# EasyEDA Pro project reflow_controller_v2_with_serial_tx_rx_easyeda.epro

# Schematic reflow_controller_v2
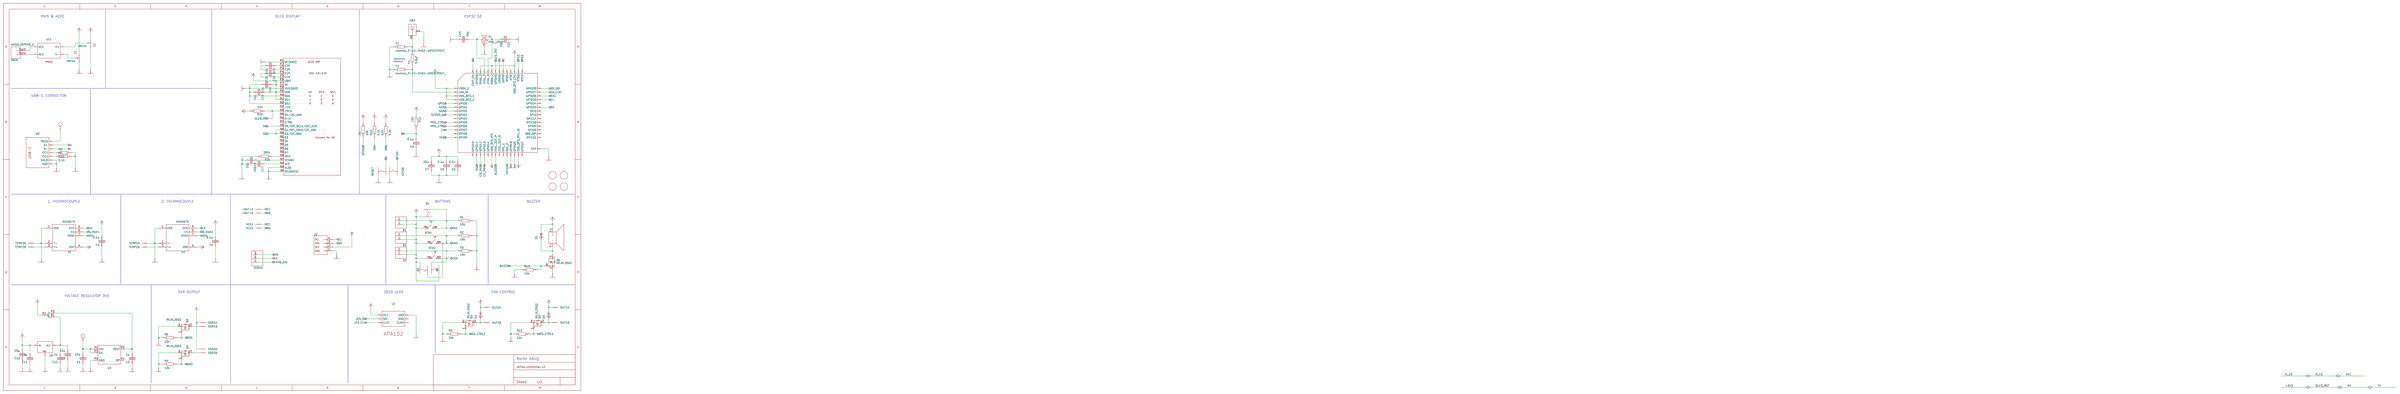
[diagram p0: schematic sheet]

## Parts
-OUT+  MOLEX_2MM_2P  (sections G$1,G$2)
B1  PINHD-1X02_2.00
B2  PINHD-1X02_2.00
B3  PINHD-1X02_2.00
B4  BUTTON_4PIN_TS-1070A
B5  BUTTON_4PIN_TS-1070A
B6  BUTTON_4PIN_TS-1070A
BTN1  BUTTON_6X6_SILICON
BTN2  BUTTON_6X6_SILICON
BTN3  BUTTON_6X6_SILICON
C1  10µ  [C0603]
C2  1µ
C3  0,1µ
C4  0,1µ
C5  0,1µ
C6  0,1µ
C7  10µ  [C0603]
C8  10µ  [C0603]
C9  0,1µ
C11  1µ
C12  1µ
C13  10µ  [C0603]
C14  2,2µ
C15  10p
C16  2,2µ
C17  10µ  [C0603]
C18  10µ  [C0603]
C19  10µ  [C0603]
C20  0,1µ
C21  10p
D1  DIODESOD-123
D2  DIODESOD-123
D4  DIODESOD-123
ESP  ESP32_S2_QFN56_NEW
F1  5.6pF
F2  moekoe_R-EU-0402-WOKEEPOUT_
F3  moekoe_R-EU-0402-WOKEEPOUT_
FRAME1  A3L-LOC
GPIO0  BUTTON_4PIN_TS_1177
J2  QWIIC_CONNECTORJS-1MM
JMP1  0R-JUMPA  (sections -0R,G$2)
JMP2  0R-JUMPA  (sections -0R,G$2)
L1  APA102_2020
MAIN  WAGO_AST045_2
OUT1  MOLEX_2MM_2P  (sections G$1,G$2)
OUT2  MOLEX_2MM_2P  (sections G$1,G$2)
Q1  IRLML2502
Q2  IRLML2502
Q4  IRLML2502
Q5  IRLML2502
Q6  IRLML2502
R1  10k
R2  10k
R3  10k
R4  10k
R5  10k
R6  5.1k
R7  5.1k
R8  10k
R9  10k
R11  10k
R12  10k
R13  10k
R20  10k
R21  390k
R22  5.1k
R23  5.1k
RESET  BUTTON_4PIN_TS_1177
S1  SWITCH_MS-22C01-G010
SERVO  PINHD-1X03_2.54
SSR1  MOLEX_2MM_2P  (sections G$1,G$2)
SSR2  MOLEX_2MM_2P  (sections G$1,G$2)
TEMP1  MOLEX_2MM_2P  (sections G$1,G$2)
TEMP2  MOLEX_2MM_2P  (sections G$1,G$2)
U1  MAX6675
U2  MAX6675
U3  RT9193_SC70-5
U4  OLD_096_SSD1306_30P_2B
U8  V_REG_LM1117SOT223
U9  USB_C_C393939
U10  MLT-5030-BUZZER
U11  HILINK_PM03
U$1  FIDUCIAL
U$2  FIDUCIAL
U$3  UFL_ANT_CONNECTOR
U$4  FIDUCIAL
U$5  FIDUCIAL
VCC  MOLEX_2MM_2P  (sections G$1,G$2)
X1  XTAL_2016

## Library data of the parts
-OUT+ OUT1 OUT2 SSR1 SSR2 TEMP1 TEMP2 VCC = iml_apollo_MOLEX_2MM_2P_
B1-B3 = pinhead-2_PINHD-1X02__2.00
B4-B6 = moekoe_BUTTON_4PIN__TS-1070A
BTN1-BTN3 = moekoe_BUTTON_6X6_SILICON_
C1-C3 C5 C7-C9 C11-C21 = moekoe_C-EU_WO_KEEPOUT_
C4 C6 = rcl_C-EU_C0603
D1 D2 D4 = adafruit_DIODE_SOD-123
ESP = moekoe_ESP32_S2_QFN56__NEW
F1-F3 = moekoe_R-EU-0402-WOKEEPOUT_
FRAME1 = frames_A3L-LOC_: DRAWING_NAME: reflow_controller_v2; SHEET: 1/1
GPIO0 RESET = moekoe_BUTTON_4PIN__TS_1177
J2 = SparkFun-Connectors_QWIIC_CONNECTOR_JS-1MM
JMP1 JMP2 = jump-0r-smd_0R-JUMP_A
L1 = moekoe_APA102_2020_
MAIN = moekoe_WAGO_AST045_2_
Q1 Q2 Q4-Q6 = moekoe_IRLML2502_
R1-R9 R11-R13 R20-R23 = moekoe_R-EU_WO_KEEPOUT_
S1 = moekoe_SWITCH_MS-22C01-G010_
SERVO = pinhead-2_PINHD-1X03__2.54
U1 U2 = max6675_MAX6675_
U3 = moekoe_RT9193_SC70-5_
U4 = moekoe_OLD_096_SSD1306_30P__2B
U8 = SparkFun-IC-Power_V_REG_LM1117_SOT223
U9 = moekoe_USB_C_C393939_
U10 = moekoe_MLT-5030-BUZZER_
U11 = moekoe_HILINK_PM03_
U$1 U$2 U$4 U$5 = adafruit_FIDUCIAL_
U$3 = moekoe_UFL_ANT_CONNECTOR_
X1 = moekoe_XTAL_2016_

## Nets
+3V3: B1.1 B2.1 B3.1 B4.P$2(3) B5.P$2(3) B6.P$2(3) BTN1.P$1(P1) BTN2.P$1(P1) BTN3.P$1(P1) C3.2 C4.2 C5.2 C6.2 C7.2 C18.1 C20.1 D1.C ESP.1(VDDA) ESP.3(VDD_3P3_1) ESP.4(VDD_3P3_2) ESP.20(VDD_3P3_RTC) ESP.27(VDD_3P3_RTC_IO) ESP.45(VDD_3P3_CPU) ESP.48(U0TXD) ESP.49(U0RXD) ESP.50(GPIO45) ESP.51(VDDA_2) ESP.54(VDDA_3) J2.2(VCC) L1.P1*2(VCC) R9.2 R11.1 R20.1 R20.2 R22.2 R23.2 S1.P2(2) U1.4(VDD) U2.4(VDD) U4.P6(VBAT) U4.P9(VDD) U4.P11(BS1) U4.P14(/RES) U10.P+
GND: -OUT+.2(S) C1.1 C2.1 C3.1 C4.1 C5.1 C6.1 C7.1 C8.1 C9.1 C11.1 C12.1 C13.1 C15.1 C17.2 C18.2 C19.2 C20.2 C21.1 ESP.57(EXP) F2.1 F3.1 GPIO0.P1(1) J2.1(GND) JMP1.1 JMP2.1 L1.P6*2(GND) Q1.2(S) Q2.2(S) Q4.2(S) Q5.2(S) Q6.2(S) R1.2 R2.2 R3.2 R4.1 R5.1 R6.2 R7.2 R8.1 R12.1 R13.1 R21.2 RESET.P1(1) SERVO.3 TEMP1.1(S) TEMP2.1(S) U1.1(VSS) U1.2(T-) U2.1(VSS) U2.2(T-) U3.P2(GND) U4.P1(NC(GND)) U4.P8(VSS(GND)) U4.P10(BS0) U4.P12(BS2) U4.P29(VLSS) U4.P30(NC(GND2)) U8.1(ADJ) U9.A1B12*2(GND) U9.S1*4(SHLD) U$3.P1.-*2(GND) VCC.2(S) X1.P2*2(G)
VCC: -OUT+.1(S) C11.2 C13.2 D2.C D4.C JMP1.3 JMP2.2 JMP2.3 OUT1.1(S) OUT2.1(S) SERVO.2 SSR1.1(S) SSR2.1(S) U8.3(IN) U11.V+ VCC.1(S)
ANTENNA1: F1.2 F2.2 U$3.ANT
BTN1: B1.2 B4.P$4(2) BTN1.P$2(P2) ESP.40(GPIO36) R1.1
BTN2: B2.2 B5.P$4(2) BTN2.P$2(P2) ESP.43(MTCK) R2.1
BTN3: B3.2 B6.P$4(2) BTN3.P$2(P2) ESP.44(MTDO) R3.1
BUZZER: ESP.21(XTAL_32K_P) Q6.1(G) R13.2
CLK: ESP.12(GPIO7) U1.5(SCK) U2.5(SCK)
CS_MAX1: ESP.18(GPIO13) U1.6(CS)
CS_MAX2: ESP.17(GPIO12) U2.6(CS)
D+: ESP.26(GPIO20) U9.A6*2(D+)
D-: ESP.25(GPIO19) U9.A7*2(D-)
EN: C9.2 ESP.56(CHIP_PU) R11.2 RESET.P4(4)
GPIO0: ESP.5(GPIO0) GPIO0.P4(4)
GPIO18: ESP.24(DAC_2) R9.1
LED_CLKI: ESP.41(GPIO37) L1.P5(CLKI)
LED_SDI: ESP.42(GPIO38) L1.P4(SDI)
MISO: ESP.14(GPIO9) U1.7(MISO) U2.7(MISO)
MOS_CTRL1: ESP.11(GPIO6) Q2.1(G) R12.2
MOS_CTRL2: ESP.10(GPIO5) Q1.1(G) R5.2
MOSI: ESP.16(GPIO11)
N_1: MAIN.P1.1*2(1) U11.AC1
N_2: TEMP2.2(S) U1.3(T+)
N_3: MAIN.P2.1*2(2) U11.AC2
N_4: ESP.2(LNA_IN) F1.1 F3.2
N_5: D2.A OUT2.2(S) Q1.3(D)
N_6: D1.A Q6.3(D) U10.P-
N_7: D4.A OUT1.2(S) Q2.3(D)
N_9: Q4.3(D) SSR2.2(S)
N_11: C15.2 ESP.53(XTAL_P) X1.P1(1)
N_12: C21.2 ESP.52(XTAL_N) X1.P3(2)
N_14: TEMP1.2(S) U2.3(T+)
N_16: C8.2 C12.2 S1.P1(1) U8.2*2(OUT)
N_17: C14.1 U4.P2(C2P)
N_18: R7.1 U9.B5(CC2)
N_19: C14.2 U4.P3(C2N)
N_20: C16.2 U4.P5(C1N)
N_21: R21.1 U4.P26(IREF)
N_22: C2.2 S1.P3(3) U3.P5(VOUT)
N_23: JMP1.2 U11.V-
N_25: R6.1 U9.A5(CC1)
N_31: C16.1 U4.P4(C1P)
N_32: C17.1 U4.P28(VCC)
N_33: C19.1 U4.P27(VCOMH)
SCL: ESP.39(GPIO35) J2.4(SCL) R23.1 U4.P18(D0/SPI_SCLK/I2C_SCK)
SDA: ESP.37(GPIO33) J2.3(SDA) R22.1 U4.P19(D1/SPI_SDIN/I2C_SDA) U4.P20(D2/I2C_SDA)
SERVO_SIG: ESP.8(GPIO3) SERVO.1
SSR1: ESP.6(GPIO1) Q5.1(G) R8.2
SSR2: ESP.7(GPIO2) Q4.1(G) R4.2
VPP: C1.2 U3.P1(VIN) U3.P3(EN) U9.A4B9*2(VBUS)
N$10: Q5.3(D) SSR1.2(S)

Not connected (* = marked no-connect by the designer): B4 P$1(1) P$3(4); B5 P$1(1) P$3(4); B6 P$1(1) P$3(4); ESP 9(GPIO4) 13(GPIO8) 15(GPIO10) 19(GPIO14) 22(XTAL_32K_N) 23(DAC_1) 28(GPIO21) 29(SPICS1) 30(VDD_SPI) 31(SPIHD) 32(SPIWP) 33(SPICS0) 34(SPICLK) 35(SPIQ) 36(SPID) 38(GPIO34) 46(MTDI) 47(MTMS) 55(GPIO46); GPIO0 P2(2) P3(3); L1 P2(CLKO) P3(SDO); RESET P2(2) P3(3); U3 P4(BP); U4 P7(NC) P13(/CS) P15(DC/I2C_SA0) P16(R/W) P17(E/RD) P21(D3) P22(D4) P23(D5) P24(D6) P25(D7)

## Notes on the sheet
- MAIN & ACDC
- OLED DISPLAY
- ESP32 S2
- matching
  network
- USB-C CONNECTOR
- 1. THERMOCOUPLE
- 2. THERMOCOUPLE
- BUTTONS
- BUZZER
- SSR OUTPUT
- 2020 LEDS
- FAN CONTROL
- VOLTAGE REGULATOR 3V3
- Moritz König

# Board reflow_controller_v2
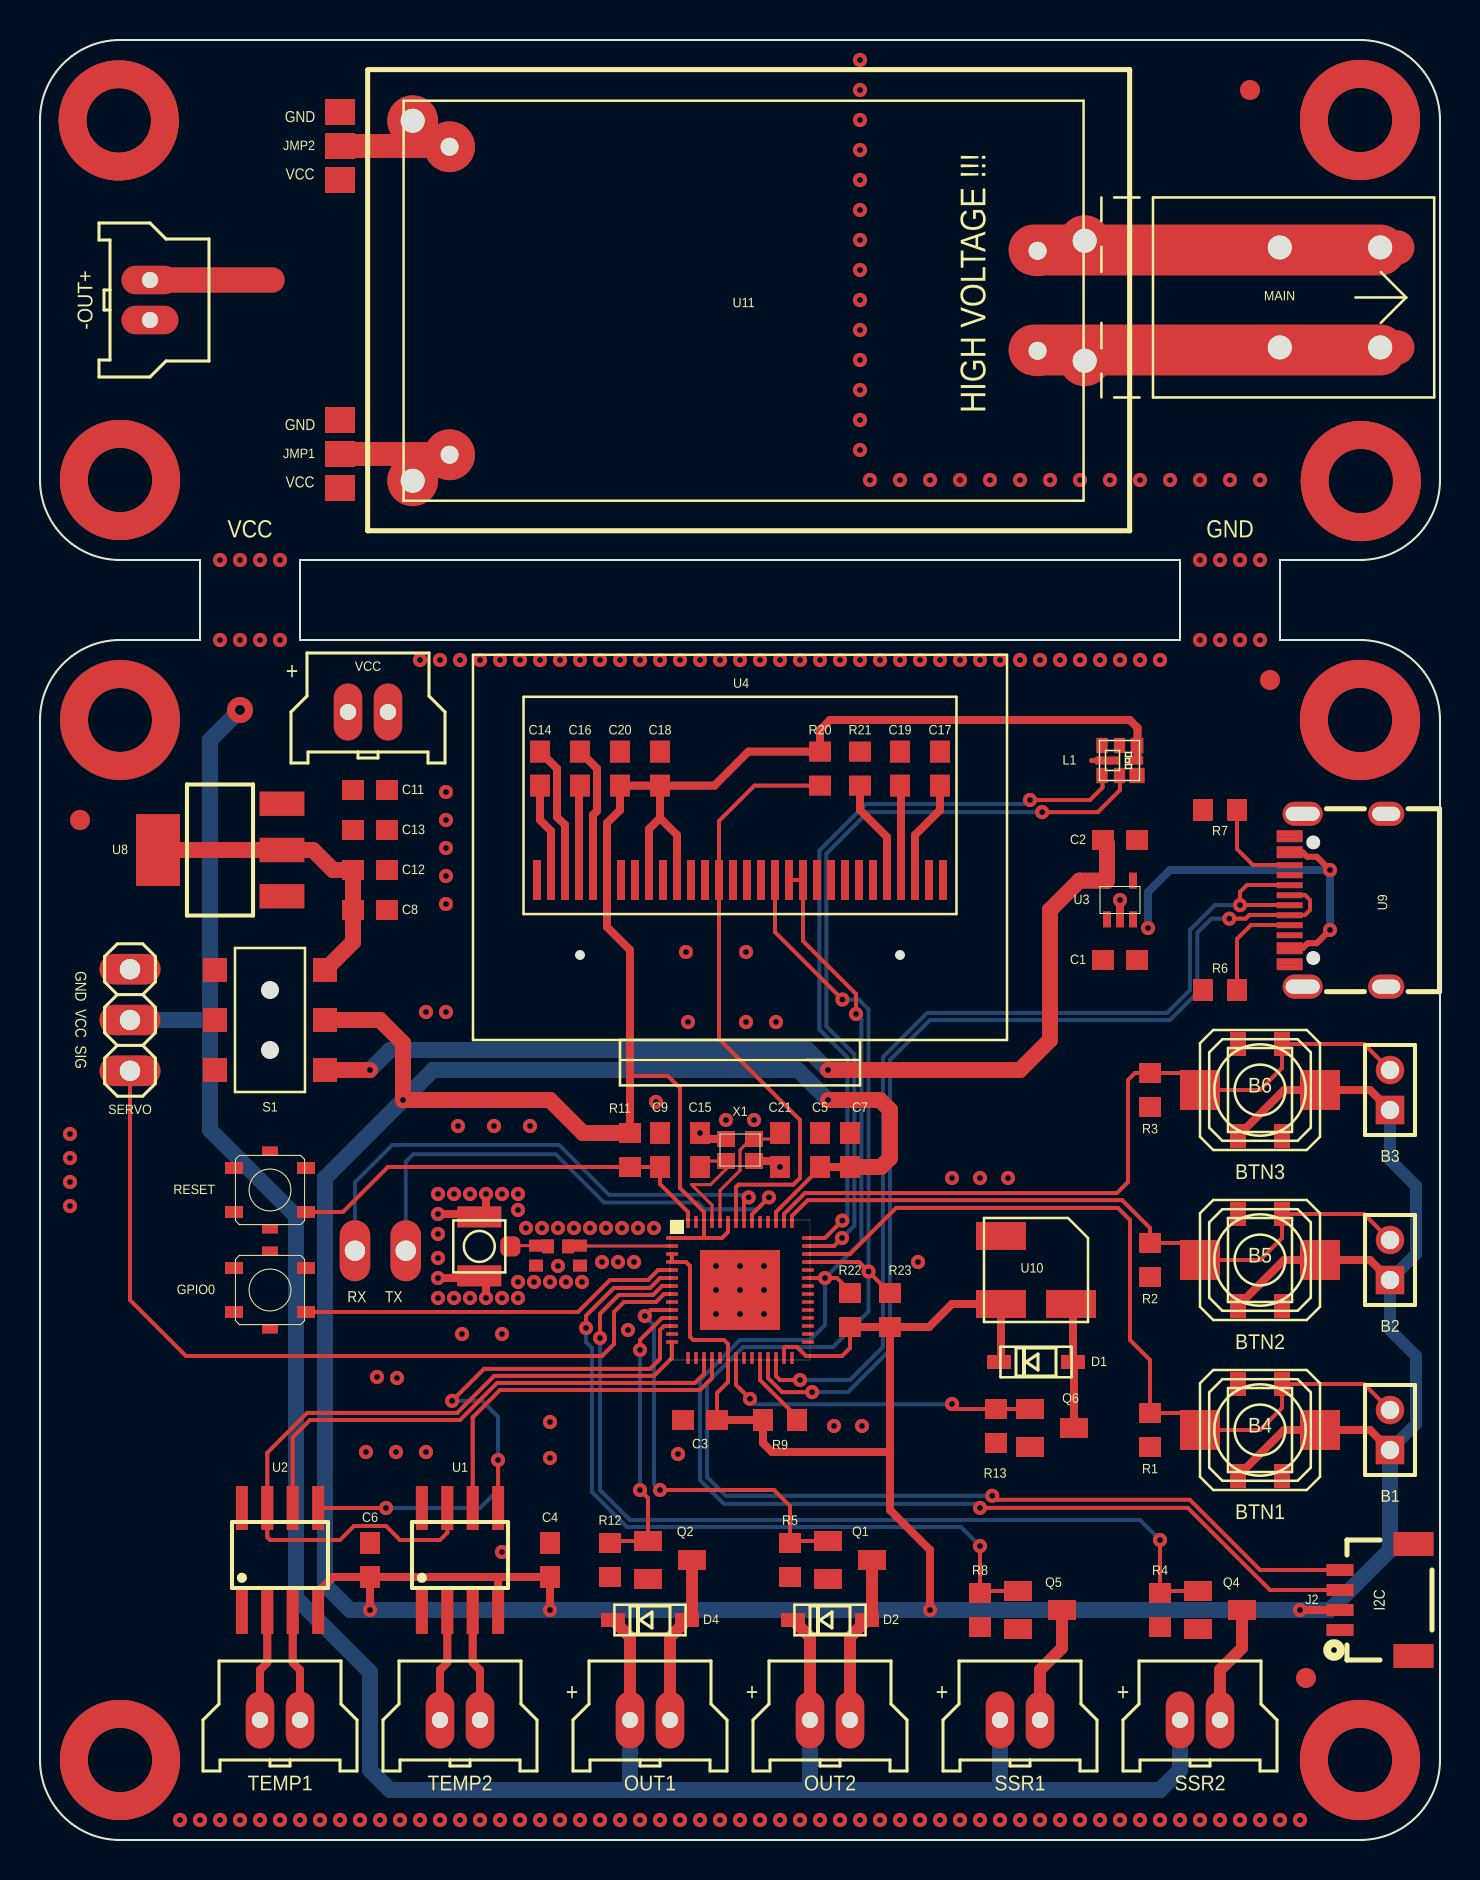
[diagram p1: board, top side]
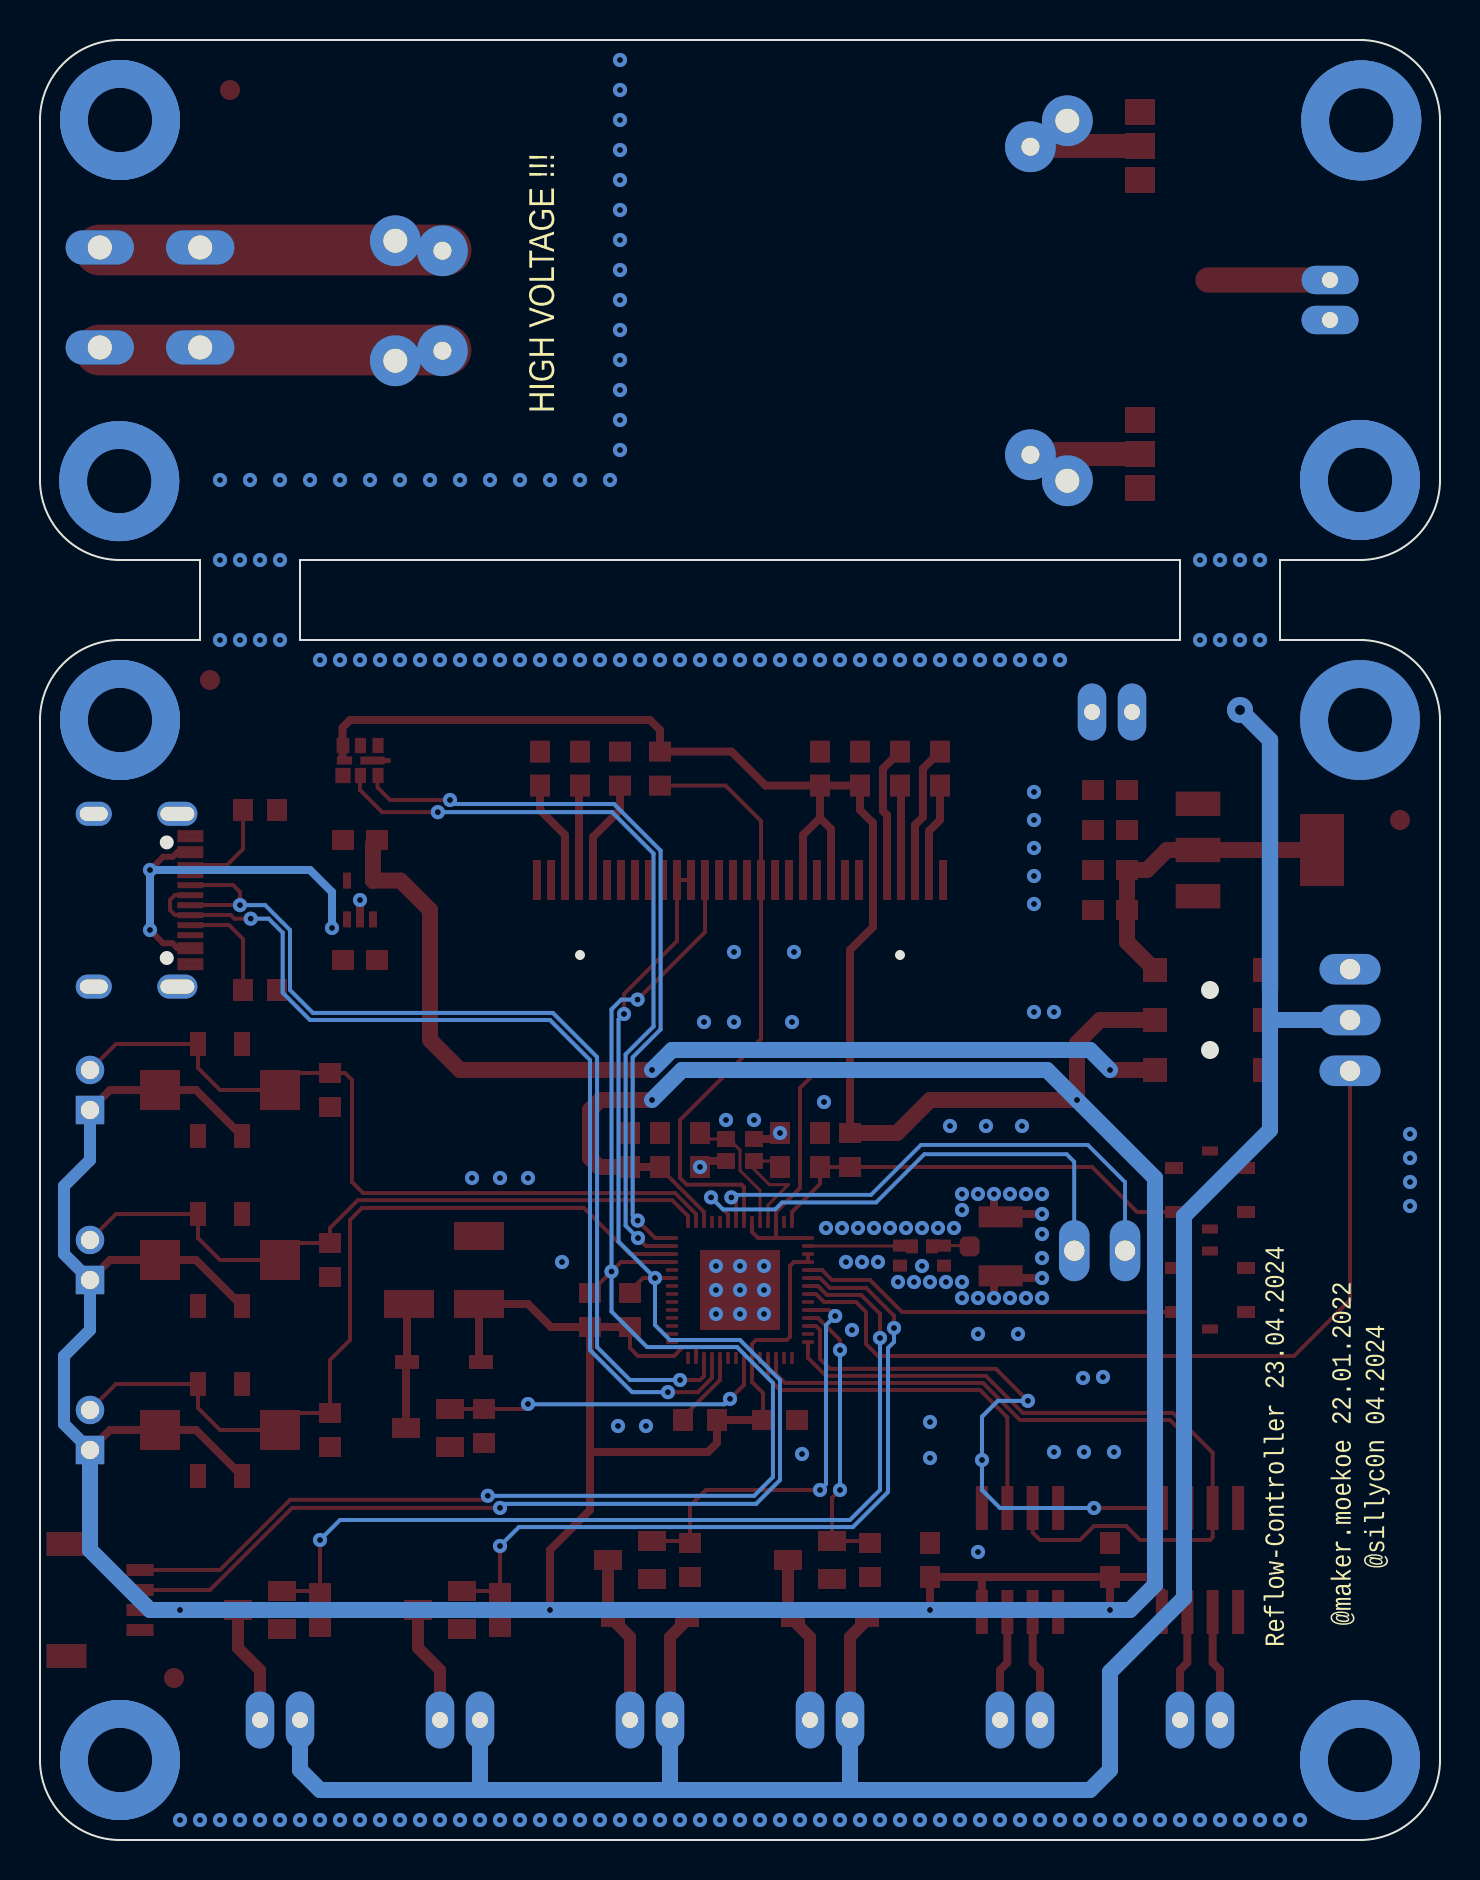
[diagram p2: board, bottom side, seen from below]

Outline 70 x 90 mm; copper layers: Top Layer, Bottom Layer. Coordinates in mm from the lower left corner of the outline.
Outline path: 0,86 arc(1.17,88.83) 4,90 66,90 arc(68.83,88.83) 70,86 70,68 arc(68.83,65.17) 66,64 62,64 62,60 66,60 arc(68.83,58.83) 70,56 70,4 arc(68.83,1.17) 66,0 4,0 arc(1.17,1.17) 0,4 0,56 arc(1.17,58.83) 4,60 8,60 8,64 4,64 arc(1.17,65.17) 0,68 0,86 ; 13,64 57,64 57,60 13,60 13,64
Stack: Top Layer 0.035mm / Dielectric1 1.51mm FR4 er 4.5 / Bottom Layer 0.035mm

## Design rules (mm)
template: User Custom Config
spacing safeClearance (default): track to track 0.152, other pairs 0 to 0.254
track width trackWidth (default): min 0.003, default 0.003, max 2.54
differential pair differentialPair (default): width min 0.127, default 0.254, max 2.54; gap min 0.152, default 0.152
via viaSize (default): diameter min 0, default 0, max 5.999; hole min 0, default 0, max 3.2
net GND uses CopperRegion6
net VCC uses CopperRegion5
net VPP uses CopperRegion6
pour ie21 uses CopperRegion1
pour ie22 uses CopperRegion6
pour ie23 uses CopperRegion3
pour ie378 uses CopperRegion6
pour ie673 uses CopperRegion6
pour e15454 uses CopperRegion6
pour ie20 uses CopperRegion2

## Placement (name value [footprint] x y rotation side)
-OUT+  -  [MOLEX_2MM_2P]  5.5 77 270 top
B1  PINHD-1X02_2.00  [1X02M]  67.5 20.5 90 top
B2  PINHD-1X02_2.00  [1X02M]  67.5 29 90 top
B3  PINHD-1X02_2.00  [1X02M]  67.5 37.5 90 top
B4  BUTTON_4PIN_TS-1070A  [BUTTON_WHITE_SMD]  61 20.5 270 top
B5  BUTTON_4PIN_TS-1070A  [BUTTON_WHITE_SMD]  61 29 270 top
B6  BUTTON_4PIN_TS-1070A  [BUTTON_WHITE_SMD]  61 37.5 270 top
BTN1  BUTTON_6X6_SILICON  [BUTTON_SILICON]  61 20.5 180 top
BTN2  BUTTON_6X6_SILICON  [BUTTON_SILICON]  61 29 180 top
BTN3  BUTTON_6X6_SILICON  [BUTTON_SILICON]  61 37.5 180 top
C1  10µ  [C0603]  54 44 180 top
C2  1µ  [C0603]  54 50 180 top
C3  0,1µ  [C0603]  33 21 0 top
C4  0,1µ  [C0603]  25.5 14 270 top
C5  0,1µ  [C0603]  39 34.5 270 top
C6  0,1µ  [C0603]  16.5 14 270 top
C7  10µ  [C0603]  40.5 34.5 270 top
C8  10µ  [C0603]  16.5 46.5 180 top
C9  0,1µ  [C0603]  31 34.5 270 top
C11  1µ  [C0603]  16.5 52.5 180 top
C12  1µ  [C0603]  16.5 48.5 180 top
C13  10µ  [C0603]  16.5 50.5 180 top
C14  2,2µ  [C0603]  25 53.57 90 top
C15  10p  [C0603]  33 34.5 270 top
C16  2,2µ  [C0603]  27 53.57 90 top
C17  10µ  [C0603]  45 53.57 90 top
C18  10µ  [C0603]  31 53.57 90 top
C19  10µ  [C0603]  43 53.57 90 top
C20  0,1µ  [C0603]  29 53.57 90 top
C21  10p  [C0603]  37 34.5 90 top
D1  DIODESOD-123  [SOD-123]  49.8 23.9 0 top
D2  DIODESOD-123  [SOD-123]  39.5 11 0 top
D4  DIODESOD-123  [SOD-123]  30.5 11 0 top
ESP  ESP32_S2_QFN56_NEW  [QFN56_7X7]  35 27.5 0 top
F1  5.6pF  [R0402]  25.9 29.68 180 top
F2  moekoe_R-EU-0402-WOKEEPOUT_  [R0402]  24.8 29.22 90 top
F3  moekoe_R-EU-0402-WOKEEPOUT_  [R0402]  27 29.22 90 top
GPIO0  BUTTON_4PIN_TS_1177  [TS-1177-C-B-B]  11.5 27.5 0 top
J2  QWIIC_CONNECTORJS-1MM  [1X04_1MM_RA]  65 12 90 top
JMP1  0R-JUMPA  [A0R-JMP]  15 69.3 0 top
JMP2  0R-JUMPA  [A0R-JMP]  15 84.7 0 top
L1  APA102_2020  [apa102_2020]  53.97 53.97 270 top
MAIN  -  [WAGO_AST045_2]  64.5 77.13 90 top
NOREF  -  [Pad_e3409]  15.75 29.46 0 top
NOREF#2  -  [Pad_e3410]  18.29 29.46 0 top
OUT1  -  [MOLEX_2MM_2P]  30.5 6 0 top
OUT2  -  [MOLEX_2MM_2P]  39.5 6 0 top
Q1  IRLML2502  [SOT23]  40.5 14 270 top
Q2  IRLML2502  [SOT23]  31.5 14 270 top
Q4  IRLML2502  [SOT23]  59 11.5 270 top
Q5  IRLML2502  [SOT23]  50 11.5 270 top
Q6  IRLML2502  [SOT23]  50.6 20.6 270 top
R1  10k  [R0603]  55.5 20.5 270 top
R2  10k  [R0603]  55.5 29 270 top
R3  10k  [R0603]  55.5 37.5 270 top
R4  10k  [R0603]  56 11.5 90 top
R5  10k  [R0603]  37.5 14 90 top
R6  5.1k  [R0603]  59 42.5 180 top
R7  5.1k  [R0603]  59 51.5 180 top
R8  10k  [R0603]  47 11.5 90 top
R9  10k  [R0603]  37 21 180 top
R11  10k  [R0603]  29.5 34.5 270 top
R12  10k  [R0603]  28.5 14 90 top
R13  10k  [R0603]  47.8 20.7 90 top
R20  10k  [R0603]  39 53.57 90 top
R21  390k  [R0603]  41 53.57 90 top
R22  5.1k  [R0603]  40.5 26.5 270 top
R23  5.1k  [R0603]  42.5 26.5 270 top
RESET  BUTTON_4PIN_TS_1177  [TS-1177-C-B-B]  11.5 32.5 0 top
S1  SWITCH_MS-22C01-G010  [MS-22C01-G010]  11.5 41 270 top
SERVO  PINHD-1X03_2.54  [1X03]  4.5 41 90 top
SSR1  -  [MOLEX_2MM_2P]  49 6 0 top
SSR2  -  [MOLEX_2MM_2P]  58 6 0 top
TEMP1  -  [MOLEX_2MM_2P]  12 6 0 top
TEMP2  -  [MOLEX_2MM_2P]  21 6 0 top
U1  MAX6675  [SO08]  21 14 0 top
U2  MAX6675  [SO08]  12 14 0 top
U3  RT9193_SC70-5  [SC-70-5]  54 47 180 top
U4  OLD_096_SSD1306_30P_2B  [OLED_096_30P_B]  35 28 0 top
U8  V_REG_LM1117SOT223  [SOT223]  9 49.5 90 top
U9  USB_C_C393939  [USB-C-SMD_KH-TYPE-C-16P]  64.9 46.99 90 top
U10  -  [MLT-5030-BUZZER]  49.8 28.5 270 top
U11  -  [HILINK_PM03]  35.18 76.96 180 top
U12  HLK-5M05  [pwrm-th_hlk-5m05]  35.43 76.96 180 top
U$1  FIDUCIAL  [FIDUCIAL_1MM]  60.5 87.5 0 top
U$2  FIDUCIAL  [FIDUCIAL_1MM]  61.5 58 0 top
U$3  -  [UFL_ANT_CONNECTOR]  21.97 29.68 270 top
U$4  FIDUCIAL  [FIDUCIAL_1MM]  2 51 0 top
U$5  FIDUCIAL  [FIDUCIAL_1MM]  63.3 8.1 0 top
VCC  -  [MOLEX_2MM_2P]  16.4 56.4 0 top
X1  XTAL_2016  [XTYL_2016]  35 34.5 0 top

## Footprints (pads in the part's own frame, mm; a bottom-side part is the same pattern mirrored in y, then rotated)
1X02M
  rect 1.423x1.423 hole 0.914: 1(-1,0)
  round 1.423 hole 0.914: 2(1,0)
1X03
  oval 1.524x3.048 hole 1.016: 1(-2.54,0) 2(0,0) 3(2.54,0)
1X04_1MM_RA
  rect 0.6x1.35 smd: 1(-1.5,0) 2(-0.5,0) 3(0.5,0) 4(1.5,0)
  rect 1.2x2 smd: NC1(2.8,-3.675) NC2(-2.8,-3.675)
A0R-JMP
  rect 1.5x1.3 smd: 1(0,1.7) 2(0,0) 3(0,-1.7)
apa102_2020
  rect 0.762x0.635 smd: P1(-0.75,0.875)
  rect 0.406x0.762 smd: P1.1(0,0.8)
  rect 0.762x0.559 smd: P2(-0.75,0) P3(-0.75,-0.875) P4(0.75,-0.875) P5(0.75,0)
  rect 0.762x0.762 smd: P6(0.75,0.875)
  rect 0.4x1.219 smd: P6.1(0,-0.6)
BUTTON_SILICON
  rect 2x2 smd: P$1(-3,0) P$2(3,0)
BUTTON_WHITE_SMD
  rect 1.2x0.8 smd: P$1(2.3,1.1) P$2(2.3,-1.1) P$3(-2.3,-1.1) P$4(-2.3,1.1)
C0603
  rect 1.1x1 smd: 1(-0.85,0) 2(0.85,0)
FIDUCIAL_1MM
  round 1 smd: 1(0,0)
HILINK_PM03
  round 2.54 hole 0.9: AC1(-14.7,2.5) AC2(-14.7,-2.5) V+(14.7,-7.7) V-(14.7,7.7)
MLT-5030-BUZZER
  rect 1.4x2.5 smd: NC(-1.7,-1.75) P+(1.7,-1.75) P-(1.7,1.75)
MOLEX_2MM_2P
  oval 1.423x2.845 hole 0.8: 1(-1,0) 2(1,0)
MS-22C01-G010
  rect 1.2x1.2 smd: P1(-2.5,2.75) P2(0,2.75) P3(2.5,2.75) P4(-2.5,-2.75) P5(0,-2.75) P6(2.5,-2.75)
OLED_096_30P_B
  rect 0.4x2 smd: P1(-10.15,20) P2(-9.45,20) P3(-8.75,20) P4(-8.05,20) P5(-7.35,20) P6(-6.65,20) P7(-5.95,20) P8(-5.25,20) P9(-4.55,20) P10(-3.85,20) P11(-3.15,20) P12(-2.45,20) P13(-1.75,20) P14(-1.05,20) P15(-0.35,20) P16(0.35,20) P17(1.05,20) P18(1.75,20) P19(2.45,20) P20(3.15,20) P21(3.85,20) P22(4.55,20) P23(5.25,20) P24(5.95,20) P25(6.65,20) P26(7.35,20) P27(8.05,20) P28(8.75,20) P29(9.45,20) P30(10.15,20)
Pad_e3409
  oval 1.524x3.048 hole 1.016: 58(0,0)
Pad_e3410
  oval 1.524x3.048 hole 1.016: 59(0,0)
pwrm-th_hlk-5m05
  round 2.54 hole 1.2x0.899: 1(-16.8,3) 2(-16.8,-3) 3(16.8,9) 4(16.8,-9)
QFN56_7X7
  rect 0.6x0.18 smd: 1(-3.4,2.6) 2(-3.4,2.2) 3(-3.4,1.8) 4(-3.4,1.4) 5(-3.4,1) 6(-3.4,0.6) 7(-3.4,0.2) 8(-3.4,-0.2) 9(-3.4,-0.6) 10(-3.4,-1) 11(-3.4,-1.4) 12(-3.4,-1.8) 13(-3.4,-2.2) 14(-3.4,-2.6) 29(3.4,-2.6) 30(3.4,-2.2) 31(3.4,-1.8) 32(3.4,-1.4) 33(3.4,-1) 34(3.4,-0.6) 35(3.4,-0.2) 36(3.4,0.2) 37(3.4,0.6) 38(3.4,1) 39(3.4,1.4) 40(3.4,1.8) 41(3.4,2.2) 42(3.4,2.6)
  rect 0.18x0.6 smd: 15(-2.6,-3.4) 16(-2.2,-3.4) 17(-1.8,-3.4) 18(-1.4,-3.4) 19(-1,-3.4) 20(-0.6,-3.4) 21(-0.2,-3.4) 22(0.2,-3.4) 23(0.6,-3.4) 24(1,-3.4) 25(1.4,-3.4) 26(1.8,-3.4) 27(2.2,-3.4) 28(2.6,-3.4) 43(2.6,3.4) 44(2.2,3.4) 45(1.8,3.4) 46(1.4,3.4) 47(1,3.4) 48(0.6,3.4) 49(0.2,3.4) 50(-0.2,3.4) 51(-0.6,3.4) 52(-1,3.4) 53(-1.4,3.4) 54(-1.8,3.4) 55(-2.2,3.4) 56(-2.6,3.4)
  rect 4x4 smd: 57(0,0)
R0402
  rect 0.6x0.7 smd: 1(-0.5,0) 2(0.5,0)
R0603
  rect 1x1.1 smd: 1(-0.85,0) 2(0.85,0)
SC-70-5
  rect 0.4x0.8 smd: P1(0.65,0.97) P2(0,0.97) P3(-0.65,0.97) P4(-0.65,-0.97) P5(0.65,-0.97)
SO08
  rect 0.6x2.2 smd: 1(-1.905,-2.6) 2(-0.635,-2.6) 3(0.635,-2.6) 4(1.905,-2.6) 5(1.905,2.6) 6(0.635,2.6) 7(-0.635,2.6) 8(-1.905,2.6)
SOD-123
  rect 1.2x0.7 smd: A(1.85,0) C(-1.85,0)
SOT23
  rect 1x1.4 smd: 1(-0.95,-1.1) 2(0.95,-1.1) 3(0,1.1)
SOT223
  rect 1.219x2.235 smd: 1(-2.312,-3.099) 2(0,-3.099) 3(2.312,-3.099)
  rect 3.6x2.2 smd: 4(0,3.099)
TS-1177-C-B-B
  rect 0.8x0.45 smd: P$5(0,1.95) P$6(0,-1.95)
  rect 0.9x0.6 smd: P1(-1.8,1.1) P2(1.8,1.1) P3(-1.8,-1.1) P4(1.8,-1.1)
UFL_ANT_CONNECTOR
  rrect 1x1 smd: ANT(0,1.55)
  rect 1.05x2.2 smd: P1.-(-1.475,0) P2.-(1.475,0)
USB-C-SMD_KH-TYPE-C-16P
  oval 1.2x2 hole 0.7x1.7: 1(-4.32,1.765) 2(4.32,1.765)
  oval 1.2x1.8 hole 0.7x1.4: 3(-4.32,-2.415) 4(4.32,-2.415)
  rect 0.3x1.3 smd: A1(-3.35,2.415) A4(-2.55,2.415) A5(-1.25,2.415) A6(-0.25,2.415) A7(0.25,2.415) A8(1.25,2.415) A9(2.55,2.415) A12(3.35,2.415) B1(3.05,2.415) B4(2.25,2.415) B5(1.75,2.415) B6(0.75,2.415) B7(-0.75,2.415) B8(-1.75,2.415) B9(-2.25,2.415) B12(-3.05,2.415)
WAGO_AST045_2
  oval 1.708x3.416 hole 1.2: P1.1(-2.5,2.51) P1.2(-2.5,-2.51) P2.1(2.5,2.51) P2.2(2.5,-2.51)
XTYL_2016
  rect 0.9x0.8 smd: P1(-0.7,-0.55) P2(0.7,-0.55) P3(0.7,0.55) P4(-0.7,0.55)

## Nets
+3V3: B1.1 B2.1 B3.1 B4.P$2 B5.P$2 B6.P$2 BTN1.P$1 BTN2.P$1 BTN3.P$1 C3.2 C4.2 C5.2 C6.2 C7.2 C18.1 C20.1 D1.C ESP.1 ESP.3 ESP.4 ESP.20 ESP.27 ESP.45 ESP.51 ESP.54 J2.2 L1.P1 L1.P1.1 R9.2 R11.1 R20.2 R22.2 R23.2 S1.P2 U1.4 U2.4 U4.P6 U4.P9 U4.P11 U10.P+
GND: -OUT+.2 C1.1 C2.1 C3.1 C4.1 C5.1 C6.1 C7.1 C8.1 C9.1 C11.1 C12.1 C13.1 C15.1 C17.2 C18.2 C19.2 C20.2 C21.1 ESP.57 F2.1 F3.1 GPIO0.P1 J2.1 JMP1.1 JMP2.1 L1.P6 L1.P6.1 Q1.2 Q2.2 Q4.2 Q5.2 Q6.2 R1.2 R2.2 R3.2 R4.1 R5.1 R6.2 R7.2 R8.1 R12.1 R13.1 R21.2 RESET.P1 SERVO.3 TEMP1.1 TEMP2.1 U1.1 U1.2 U2.1 U2.2 U3.P2 U4.P1 U4.P8 U4.P10 U4.P12 U4.P13 U4.P15 U4.P16 U4.P17 U4.P21 U4.P22 U4.P23 U4.P24 U4.P25 U4.P29 U4.P30 U8.1 U9.A1 U9.A12 U9.B1 U9.B12 U$3.P1.- U$3.P2.- VCC.2 X1.P2 X1.P4
VCC: -OUT+.1 C11.2 C13.2 D2.C D4.C JMP1.3 JMP2.3 OUT1.1 OUT2.1 SERVO.2 SSR1.1 SSR2.1 U8.3 VCC.1
ANTENNA1: F1.2 F2.2 U$3.ANT
BTN1: B1.2 B4.P$4 BTN1.P$2 ESP.40 R1.1
BTN2: B2.2 B5.P$4 BTN2.P$2 ESP.43 R2.1
BTN3: B3.2 B6.P$4 BTN3.P$2 ESP.44 R3.1
BUZZER: ESP.21 Q6.1 R13.2
CLK: ESP.12 U1.5 U2.5
CS_MAX1: ESP.18 U1.6
CS_MAX2: ESP.17 U2.6
D+: ESP.26 U9.A6 U9.B6
D-: ESP.25 U9.A7 U9.B7
EN: C9.2 ESP.56 R11.2 RESET.P4
GPIO0: ESP.5 GPIO0.P4
GPIO18: ESP.24 R9.1
LED_CLKI: ESP.41 L1.P5
LED_SDI: ESP.42 L1.P4
MISO: ESP.14 U1.7 U2.7
MOS_CTRL1: ESP.11 Q2.1 R12.2
MOS_CTRL2: ESP.10 Q1.1 R5.2
MOSI: ESP.16
N$1: MAIN.P1.1 MAIN.P1.2 U11.AC1 U12.1
N$2: TEMP2.2 U1.3
N$3: MAIN.P2.1 MAIN.P2.2 U11.AC2 U12.2
N$4: ESP.2 F1.1 F3.2
N$5: D2.A OUT2.2 Q1.3
N$6: D1.A Q6.3 U10.P-
N$7: D4.A OUT1.2 Q2.3
N$9: Q4.3 SSR2.2
N$10: Q5.3 SSR1.2
N$11: C15.2 ESP.53 X1.P1
N$12: C21.2 ESP.52 X1.P3
N$14: TEMP1.2 U2.3
N$15: JMP2.2 U11.V+ U12.4
N$16: C8.2 C12.2 S1.P1 U8.2 U8.4
N$17: C14.1 U4.P2
N$18: R7.1 U9.B5
N$19: C14.2 U4.P3
N$20: C16.2 U4.P5
N$21: R21.1 U4.P26
N$22: C2.2 S1.P3 U3.P5
N$23: JMP1.2 U11.V- U12.3
N$25: R6.1 U9.A5
N$31: C16.1 U4.P4
N$32: C17.1 U4.P28
N$33: C19.1 U4.P27
OLED_RST: ESP.50 R20.1 U4.P14
RX: ESP.49 NOREF.58
SCL: ESP.39 J2.4 R23.1 U4.P18
SDA: ESP.37 J2.3 R22.1 U4.P19 U4.P20
SERVO_SIG: ESP.8 SERVO.1
SSR1: ESP.6 Q5.1 R8.2
SSR2: ESP.7 Q4.1 R4.2
TX: ESP.48 NOREF#2.59
VPP: C1.2 U3.P1 U3.P3 U9.A4 U9.A9 U9.B4 U9.B9

Pads without a net: B4 P$1 P$3; B5 P$1 P$3; B6 P$1 P$3; ESP 9 13 15 19 22 23 28 29 30 31 32 33 34 35 36 38 46 47 55; GPIO0 P2 P3 P$5 P$6; J2 NC1 NC2; L1 P2 P3; RESET P2 P3 P$5 P$6; S1 P4 P5 P6; U1 8; U2 8; U3 P4; U4 P7; U9 1 2 3 4 A8 B8; U10 NC; U$1 1; U$2 1; U$4 1; U$5 1

## Via types
v1: diameter 0.707, hole 0.3, Top Layer to Bottom Layer, 268 vias
v2: diameter 6, hole 3.2, Top Layer to Bottom Layer, 15 vias
v3: diameter 1.3, hole 0.5, Top Layer to Bottom Layer, 1 via

## Routing (per net, layer and track width the routed paths; a pad name or vN(x,y) marks a point on that pad's centre or on a via; arc(x,y) is an arc through that point)
+3V3: length 329.3
  Top Layer w0.2: C5.2 39,33.6 36.8,31.4 ESP.45 ; 29.5,38.2 31.4,38.2 32,37.6 32,32.6 33.2,31.4 ESP.54 33.2,30.1 ; 33.2,30.1 ESP.1 ; 33.2,30.1 34.1,30.1 34.4,30.4 ESP.51 ; C3.2 33.85,22.35 34.4,22.9 ESP.20 34.4,24.8 34.2,25 32.66,25 32.5,25.16 32.5,28.7 32.3,28.9 ESP.4 ESP.3 ; ESP.27 37.2,24.6 37.25,24.65 37.85,24.65 38.3,24.2 40.1,24.2 40.5,24.6 R22.2
  Top Layer w0.4: 42.5,19.4 42.5,16.5 44.5,14.5 v1(44.5,11.5) ; 42.5,19.4 36.6,19.4 36.15,19.85 R9.2 C3.2 ; 42.5,19.4 R23.2 ; J2.2 v1(63,11.5) ; B5.P$2 62.2,29 BTN2.P$1 66.5,29 B2.1 ; R11.1 29.5,44.5 28.35,45.65 U4.P6 28.35,50.85 29,51.5 C20.1 C18.1 ; C6.2 23,13.15 ; C6.2 v1(16.5,11.5) ; C6.2 14.65,13.15 13.91,12.41 U2.4 ; 23,13.15 C4.2 v1(25.5,11.5) ; 23,13.15 22.91,13.06 U1.4 ; C5.2 C7.2 ; R22.2 R23.2 ; R23.2 44.45,25.65 45.6,26.8 U10.P+ 48.05,24 D1.C ; 54.8,54 54.88,54.08 54.88,55.61 54.49,56 39.5,56 39,55.5 R20.2 35.42,54.42 33.72,52.72 C18.1 ; 31,51.1 30.45,50.55 U4.P9 ; 31,51.1 31.85,50.25 U4.P11 ; 31,51.1 C18.1 ; B3.1 66.5,37.5 BTN3.P$1 62.2,37.5 B6.P$2 ; B4.P$2 62.2,20.5 BTN1.P$1 66.5,20.5 B1.1
  Top Layer w0.8: v1(39.4,37) 42,37 42.5,36.5 42.5,34.1 42.05,33.65 C7.2 ; S1.P2 17,41 18.15,39.85 v1(18.15,37) 25.5,37 27.15,35.35 R11.1
  Bottom Layer w0.6: B3.1 67.5,34 68.8,32.7 68.8,29.3 B2.1 67.5,25.5 68.8,24.2 68.8,20.8 B1.1
  Bottom Layer w0.8: v1(39.4,37) 37.9,38.5 19.65,38.5 v1(18.15,37) 14.25,33.1 14.25,12.75 15.5,11.5 v1(16.5,11.5) v1(25.5,11.5) v1(44.5,11.5) v1(63,11.5) 64.5,11.5 67.5,14.5 B1.1
GND: length 22.5
  Top Layer w0.254: L1.P6.1 52.58,53.97
  Top Layer w0.4: v1(37,33.65) 36.7,33.95 X1.P2 ; TEMP2.1 20,8.5 20.37,8.87 U1.2 ; U3.P2 v1(54,47) ; TEMP1.1 11,8.5 11.36,8.87 U2.2 ; v1(33,35.35) 33.3,35.05 X1.P4 ; v1(22.3,32.3) 22.3,31.49 U$3.P1.- 21.82,31.3 v1(19.9,31.3) ; v1(22.3,27.1) 22.3,27.87 21.97,28.2 21.86,28.1 v1(19.9,28.1)
  vias: v1(1.5,35.3) v1(1.5,34.1) v1(1.5,32.9) v1(1.5,31.7) v1(7,1) v1(8,1) v1(9,1) v1(10,1) v1(11,1) v1(12,1) v1(13,1) v1(14,1) v1(15,1) v1(16,1) v1(16.3,19.4) v1(16.85,23.15) v1(17,1) v1(17.85,23.1) v1(17.8,19.4) v1(18,1) v1(19,59) v1(19,1) v1(19.3,41.4) v1(19.3,19.4) v1(19.9,32.3) v1(19.9,30.3) v1(19.9,29.1) v1(19.9,27.1) v1(20,59) v1(20,1) v1(20.3,52.4) v1(20.3,51) v1(20.3,49.6) v1(20.3,48.2) v1(20.3,46.8) v1(20.3,41.4) v1(20.7,32.3) v1(20.7,27.1) v1(20.9,35.7) v1(21,59) v1(21,1) v1(21.1,25.3) v1(21.5,32.3) v1(21.5,27.1) v1(22,59) v1(22,1) v1(22.7,35.7) v1(23,59) v1(23,1) v1(23.1,32.3) v1(23.1,27.1) v1(23.1,25.3) v1(23.1,14.4) v1(23.9,32.3) v1(23.9,31.5) v1(23.9,27.9) v1(23.9,27.1) v1(24,59) v1(24,1) v1(24.3,30.6) v1(24.5,35.7) v1(24.7,27.9) v1(25,59) v1(25,1) v1(25.1,30.6) v1(25.5,27.9) v1(25.5,20.9) v1(25.5,19.1) v1(25.9,30.6) v1(25.9,28.7) v1(26,59) v1(26,1) v1(26.3,27.9) v1(26.7,30.6) v1(27,59) v1(27,1) v1(27.1,27.9) v1(27.5,30.6) v1(28,59) v1(28,1) v1(28.1,28.9) v1(28.3,30.6) v1(28.9,28.9) v1(29,59) v1(29,1) v1(29.1,30.6) v1(29.4,25.5) v1(29.7,28.9) v1(29.9,30.6) v1(30,59) v1(30,1) v1(30.7,30.6) v1(30.8,36.9) v1(31,59) v1(31,1) v1(31.9,19.3) v1(32,59) v1(32,1) v1(32.3,44.4) v1(32.4,40.9) v1(33,59) v1(33,1) v1(33.8,28.7) v1(33.8,27.5) v1(33.8,26.3) v1(34,59) v1(34,1) v1(34.3,36) v1(35,59) v1(35,28.7) v1(35,27.5) v1(35,26.3) v1(35,1) v1(35.3,44.4) v1(35.3,40.9) v1(35.7,36) v1(36,59) v1(36,1) v1(36.2,28.7) v1(36.2,27.5) v1(36.2,26.3) v1(36.8,40.9) v1(37,59) v1(37,1) v1(38,59) v1(38,1) v1(39,59) v1(39,1) v1(39.7,20.7) v1(40,59) v1(40,1) v1(41,89) v1(41,87.5) v1(41,86) v1(41,84.5) v1(41,83) v1(41,81.5) v1(41,80) v1(41,78.5) v1(41,77) v1(41,75.5) v1(41,74) v1(41,72.5) v1(41,71) v1(41,69.5) v1(41,59) v1(41,1) v1(41.1,20.7) v1(41.5,68) v1(42,59) v1(42,1) v1(43,68) v1(43,59) v1(43,1) v1(43.9,28.9) v1(44,59) v1(44,1) v1(44.5,68) v1(45,59) v1(45,1) v1(45.6,33.1) v1(46,68) v1(46,59) v1(46,1) v1(47,59) v1(47,33.1) v1(47,1) v1(47.5,68) v1(48,59) v1(48,1) v1(48.4,33.1) v1(49,68) v1(49,59) v1(49,1) v1(50,59) v1(50,1) v1(50.5,68) v1(51,59) v1(51,1) v1(52,68) v1(52,59) v1(52,1) v1(53,59) v1(53,1) v1(53.5,68) v1(54,59) v1(54,1) v1(55,68) v1(55,59) v1(55,1) v1(56,59) v1(56,1) v1(56.5,68) v1(57,1) v1(58,68) v1(58,64) v1(58,60) v1(58,1) v1(59,64) v1(59,60) v1(59,1) v1(59.5,68) v1(60,64) v1(60,60) v1(60,1) v1(61,68) v1(61,64) v1(61,60) v1(61,1) v1(62,1) v1(63,1) v2(3.94,85.98) v2(3.94,85.98) v2(4,68) v2(4,68) v2(4,56) v2(4,4) v2(4,4) v2(66.04,67.94) v2(66.04,67.94) v2(66,56) v2(66,56) v2(66,4) v2(66,4)
VCC: length 132.1
  Top Layer w0.6: D2.C 38.5,10.15 OUT2.1 ; D4.C 29.5,10.15 OUT1.1
  Top Layer w1.27: -OUT+.1 11.6,78
  Bottom Layer w0.8: OUT2.1 38.5,2.5 ; 38.5,2.5 29.5,2.5 ; 38.5,2.5 48,2.5 ; 29.5,2.5 17.5,2.5 16.5,3.5 16.5,8.4 12.8,12.1 12.8,31.2 8.5,35.5 8.5,41 ; 29.5,2.5 OUT1.1 ; SSR2.1 57,3.5 56,2.5 48,2.5 ; 8.5,41 8.5,42.5 ; 8.5,41 SERVO.2 ; 48,2.5 SSR1.1
  Bottom Layer w0.813: 8.5,42.5 8.5,55 v3(10,56.5)
  vias: v1(9,64) v1(9,60) v1(10,64) v1(10,60) v1(11,64) v1(11,60) v1(12,64) v1(12,60)
(no net): length 0.3
  Top Layer w0.191: L1.P2 53.97,54.42
ANTENNA1: length 1.9
  Top Layer w0.152: F1.2 25.36,29.72 F2.2 23.56,29.72 U$3.ANT
BTN1: length 41.9
  Top Layer w0.2: ESP.40 40.5,29.3 42.8,31.6 53.9,31.6 54.5,31 54.5,25 55.5,24 R1.1 57.15,21.35 BTN1.P$2 61,20.5 62.1,21.6 B4.P$4 66.2,22.8 B1.2
BTN2: length 34.4
  Top Layer w0.2: B2.2 66.2,31.3 B5.P$4 62.1,30.1 61,29 BTN2.P$2 57.15,29.85 R2.1 55.5,30.6 54.1,32 38.39,32 37.6,31.2 ESP.43
BTN3: length 39.2
  Top Layer w0.2: B3.2 66.2,39.8 B6.P$4 62.1,38.6 61,37.5 BTN3.P$2 57.15,38.35 R3.1 54.75,38.35 54.4,38 54.4,32.9 53.85,32.35 38.25,32.35 37.2,31.3 ESP.44
BUZZER: length 16.6
  Top Layer w0.2: ESP.21 34.8,22.76 v1(35.5,22.06) ; Q6.1 R13.2 45.85,21.55 v1(45.6,21.8)
  Bottom Layer w0.2: v1(45.6,21.8) 45.59,21.79 35.77,21.79 v1(35.5,22.06)
CLK: length 31.4
  Top Layer w0.2: U2.5 v1(17.3,16.6) ; ESP.12 31.2,25.7 31,25.5 31,24.06 30.5,23.56 22.2,23.56 v1(20.6,21.96) ; v1(22.9,19) 22.91,19 U1.5
  Bottom Layer w0.2: v1(20.6,21.96) 22.1,21.96 22.9,21.16 v1(22.9,19) 22.9,17.5 22,16.6 v1(17.3,16.6)
CS_MAX1: length 18.3
  Top Layer w0.2: ESP.18 33.6,23.1 33,22.5 23,22.5 21.63,21.13 U1.6
CS_MAX2: length 26.2
  Top Layer w0.2: U2.6 12.64,20.13 13.5,21 21,21 22.85,22.85 32.75,22.85 33.2,23.3 ESP.17
D+: length 49.5
  Top Layer w0.2: 62.22,47.75 60.35,47.75 60,47.4 v1(60,46.74) 60.01,46.75 62.22,46.75 ; ESP.26 36.8,23.2 37,23 v1(38,23)
  Bottom Layer w0.2: v1(38,23) 40.5,23 42.15,24.65 42.15,39.15 44.35,41.35 56.35,41.35 57.5,42.5 57.5,45.5 58.74,46.74 v1(60,46.74)
D-: length 50.5
  Top Layer w0.2: v1(59.47,46.06) 60.28,46.06 60.46,46.25 63.25,46.25 63.5,46.5 63.5,47 63.25,47.25 62.22,47.25 ; v1(38.61,22.39) 37.11,22.39 36.4,23.1 ESP.25
  Bottom Layer w0.2: v1(59.47,46.06) 58.56,46.06 57.87,45.36 57.87,42.36 56.5,41 44.5,41 42.5,39 42.5,24.5 40.39,22.39 v1(38.61,22.39)
EN: length 22
  Top Layer w0.2: RESET.P4 15.14,31.4 17.39,33.65 R11.2 C9.2 31,32.8 32.4,31.4 ESP.56
GPIO0: length 19.2
  Top Layer w0.2: ESP.5 30.9,28.5 30.4,28 28.5,28 26.9,26.4 GPIO0.P4
GPIO18: length 3.9
  Top Layer w0.2: ESP.24 36,23 37.85,21.15 R9.1
LED_CLKI: length 38.7
  Top Layer w0.2: v1(50.11,51.39) 52.89,51.39 54,52.5 54,53.25 ; ESP.41 39.7,29.7 v1(40.1,30.1)
  Bottom Layer w0.2: v1(50.11,51.39) 41.39,51.39 39.32,49.32 39.32,40.68 40.72,39.28 40.72,30.72 v1(40.1,30.1)
LED_SDI: length 37.3
  Top Layer w0.2: v1(40.11,30.97) 39.24,30.1 ESP.42 ; 53.12,53.25 53.12,52.62 52.5,52 v1(49.5,52)
  Bottom Layer w0.2: v1(40.11,30.97) 40.37,31.22 40.37,39.13 38.97,40.53 38.97,49.47 41.3,51.8 49.3,51.8 v1(49.5,52)
MISO: length 38.2
  Top Layer w0.2: ESP.14 31.6,24.11 30.7,23.2 22.71,23.2 20.86,21.35 13.35,21.35 11.36,19.36 U2.7 11.36,15.13 11.5,15 15,15 15.7,15.7 17.3,15.7 18,15 20,15 20.37,15.37 U1.7
MOS_CTRL1: length 14.2
  Top Layer w0.2: ESP.11 31.1,26.1 30,25 v1(30,24.5) ; v1(30,17.5) 30.4,17.1 Q2.1 28.6,14.95 R12.2
  Bottom Layer w0.2: v1(30,24.5) v1(30,17.5)
MOS_CTRL2: length 21.1
  Top Layer w0.2: v1(31,17.5) 36.7,17.5 37.5,16.7 R5.2 37.6,14.95 Q1.1 ; ESP.10 30.54,26.5 v1(30.24,26.2)
  Bottom Layer w0.2: v1(31,17.5) 30.7,17.8 30.7,25.74 v1(30.24,26.2)
N$1: length 17.3
  Top Layer w2.54: 67.01,74.5 49.7,74.5
N$2: length 5.6
  Top Layer w0.4: TEMP2.2 22,8.5 21.63,8.87 U1.3
N$3: length 17.3
  Top Layer w2.54: 49.7,79.5 67.01,79.5
N$4: length 5.3
  Top Layer w0.152: F1.1 26.96,29.68 F3.2 27.01,29.75 27.06,29.7 ESP.2
N$5: length 8.5
  Top Layer w0.6: OUT2.2 40.5,10.15 D2.A 41.6,11.25 Q1.3
N$6: length 6.3
  Top Layer w0.4: U10.P- 51.65,26.7 D1.A 51.7,23.85 Q6.3
N$7: length 8.5
  Top Layer w0.6: OUT1.2 31.5,10.15 D4.A 32.6,11.25 Q2.3
N$9: length 6
  Top Layer w0.6: SSR2.2 59,8.5 60.1,9.6 Q4.3
N$10: length 6
  Top Layer w0.6: SSR1.2 50,8.5 51.1,9.6 Q5.3
N$11: length 6.2
  Top Layer w0.152: C15.2 33.3,33.95 X1.P1 34.3,33.54 33.53,32.77 32.58,32.77 33.6,31.74 ESP.53
N$12: length 6.4
  Top Layer w0.152: C21.2 36.7,35.05 X1.P3 35.55,35.05 35,34.5 35,33.48 34,32.48 ESP.52
N$14: length 5.6
  Top Layer w0.4: TEMP1.2 13,8.5 12.64,8.87 U2.3
N$15: length 5.3
  Top Layer w1.2: 20.3,84.7 JMP2.2
N$16: length 15.7
  Top Layer w0.8: S1.P1 15.65,44.9 C8.2 C12.2 14.65,48.5 13.65,49.5 U8.2 U8.4
N$17: length 4.9
  Top Layer w0.4: U4.P2 25.55,50.45 25,51 C14.1
N$18: length 4.7
  Top Layer w0.2: R7.1 59.85,49.55 60.65,48.75 62.22,48.75
N$19: length 6.9
  Top Layer w0.4: C14.2 25.85,53.57 25.85,51.15 26.25,50.75 U4.P3
N$20: length 6.9
  Top Layer w0.4: U4.P5 27.65,51.25 27.85,51.45 27.85,53.57 C16.2
N$21: length 5.3
  Top Layer w0.4: U4.P26 42.35,50.15 41,51.5 R21.1
N$22: length 49.8
  Top Layer w0.8: C2.2 53.35,49.8 U3.P5 51.97,47.97 50.5,46.5 50.5,40 49,38.5 v1(39.4,38.5) ; S1.P3 v1(16.5,38.5)
  Bottom Layer w0.8: v1(39.4,38.5) 38.4,39.5 17.5,39.5 v1(16.5,38.5)
N$23: length 5.3
  Top Layer w1.2: 20.3,69.3 JMP1.2
N$25: length 5.2
  Top Layer w0.2: R6.1 59.85,45.05 60.55,45.75 62.22,45.75
N$29:
  vias: v2(66,86) v2(66,86)
N$31: length 4.7
  Top Layer w0.4: U4.P4 26.95,52.67 C16.1
N$32: length 5.2
  Top Layer w0.4: U4.P28 43.75,50.25 45,51.5 C17.1
N$33: length 4.7
  Top Layer w0.4: U4.P27 43.05,52.67 C19.1
OLED_RST: length 30.6
  Top Layer w0.2: 34.8,32.64 34.93,32.77 ; 34.8,32.64 34.93,32.77 37.67,32.77 38,33.1 38,36 33.95,40.05 U4.P14 33.95,50.95 35.72,52.72 R20.1 ; 34.8,32.64 ESP.50
RX: length 26.1
  Top Layer w0.191: v1(35.43,32.13) 35.2,31.9 35.2,31.12
  Bottom Layer w0.191: v1(15.75,29.46) 15.75,32.89 17.61,34.75 25.95,34.75 28.45,32.26 35.31,32.26 v1(35.43,32.13)
SCL: length 76.6
  Top Layer w0.2: ESP.39 40.95,28.9 v1(41.43,28.42) R23.1 ; v1(40.12,42.02) 36.75,45.39 U4.P18 ; v1(47.61,17.21) 47.81,17.01 57.49,17.01 61,13.5 J2.4
  Bottom Layer w0.2: v1(40.12,42.02) 40.93,42.02 41.43,41.53 v1(41.43,28.42) 41.43,26.42 39.65,24.65 35.15,24.65 33.35,22.85 33.35,18.15 34.29,17.21 v1(47.61,17.21)
SDA: length 74.1
  Top Layer w0.2: J2.3 61.5,12.5 57.39,16.61 v1(47,16.61) ; ESP.37 v1(39.25,28.1) 39.85,28.1 40.5,27.45 R22.1 ; v1(40.8,41.3) 40.8,42.3 38.15,44.95 U4.P20 U4.P19
  Bottom Layer w0.2: v1(47,16.61) 46.8,16.81 34.19,16.81 33,18 33,23 35,25 38.5,25 39.25,25.75 v1(39.25,28.1) 41.07,29.92 41.07,41.03 v1(40.8,41.3)
SERVO_SIG: length 41.9
  Top Layer w0.2: SERVO.1 4.5,27 7.3,24.2 28.1,24.2 28.7,24.8 28.7,26.4 29.2,26.9 30.8,26.9 31.2,27.3 ESP.8
SSR1: length 38.8
  Top Layer w0.2: Q5.1 47.1,12.45 R8.2 v1(47,14.7) ; ESP.6 31,28.1 30.51,27.6 28.69,27.6 27.3,26.21 v1(27.3,25.6)
  Bottom Layer w0.2: v1(47,14.7) 46.05,15.65 29.35,15.65 27.6,17.4 27.6,24.6 27.3,24.9 v1(27.3,25.6)
SSR2: length 46.6
  Top Layer w0.2: Q4.1 56.1,12.45 R4.2 v1(56,15) ; ESP.7 31.1,27.7 30.65,27.25 28.94,27.25 28,26.31 v1(28,25.1)
  Bottom Layer w0.2: v1(56,15) 55,16 29.5,16 28,17.5 v1(28,25.1)
TX: length 25.7
  Top Layer w0.2: v1(36.45,32.13) 35.6,31.28 ESP.48
  Bottom Layer w0.191: v1(18.29,29.46) 18.29,33.91 18.67,34.29 25.78,34.29 28.19,31.88 32.89,31.88 33.24,31.53 35.85,31.53 v1(36.45,32.13)
VPP: length 19.7
  Top Layer w0.3: 62.22,44.6 63.14,44.6 63.38,44.84 63.84,44.84 v1(64.5,45.5) ; v1(64.5,48.5) 63.84,49.16 63.36,49.16 63.12,49.4 62.22,49.4
  Bottom Layer w0.4: v1(64.5,45.5) v1(64.5,48.5) 56.5,48.5 55.4,47.4 v1(55.4,45.6)

## Copper pours and planes (outline as drawn; the poured copper is in the pictures)
GND on Top Layer: 14.22,91.06 41.91,91.06 41.91,68.96 42.04,68.83 70.74,68.83 70.74,62.99 69.72,61.98 16.38,61.98 16.26,61.85 16.26,70.23 14.22,70.23 14.22,74.93 16.23,74.93 16.23,84.07 14.24,85.65
GND on Top Layer: 16.67,62.51 16.67,47.72 -1.07,47.72 -1.07,-1.04 70.79,-1.04 70.79,62.51
GND on Top Layer: -1,91 8,91 8,43.59 -1,43.59
GND on Bottom Layer: 14.97,91.13 14.97,60.08 -3.53,60.08 -3.53,-1.37 69.47,-1.37 69.47,68.63 40.74,68.63 40.74,91.13
GND on Bottom Layer: -3,91.5 40.6,91.5 40.6,64.26 -3,64.26
VCC on Top Layer: 8.25,62.34 16.38,62.34 16.38,50.01 8.25,50.01
VCC on Top Layer: 8.25,91.06 13.72,91.06 13.72,83.69 15.74,83.69 15.74,75.56 13.77,75.56 13.77,68.33 15.74,68.33 15.74,61.85 8.25,61.85
VPP on Top Layer: 52.7,46.4 52.7,43 53.9,43 53.9,44.6 54.2,44.9 56,44.9 56,46.4

## Text on the board
Bottom Silkscreen Layer: HIGH VOLTAGE !!! | Reflow-Controller 23.04.2024 / @maker.moekoe 22.01.2022 / @sillyc0n 04.2024
Top Solder Mask Layer: @maker.moekoe / @sillyc0n
Top Silkscreen Layer: GND / VCC | I2C | GND  VCC  SIG | RX     TX | VCC | + | GND | HIGH VOLTAGE !!!
